# EAGLE design EXT_ADIN (EAGLE 6.5.0)
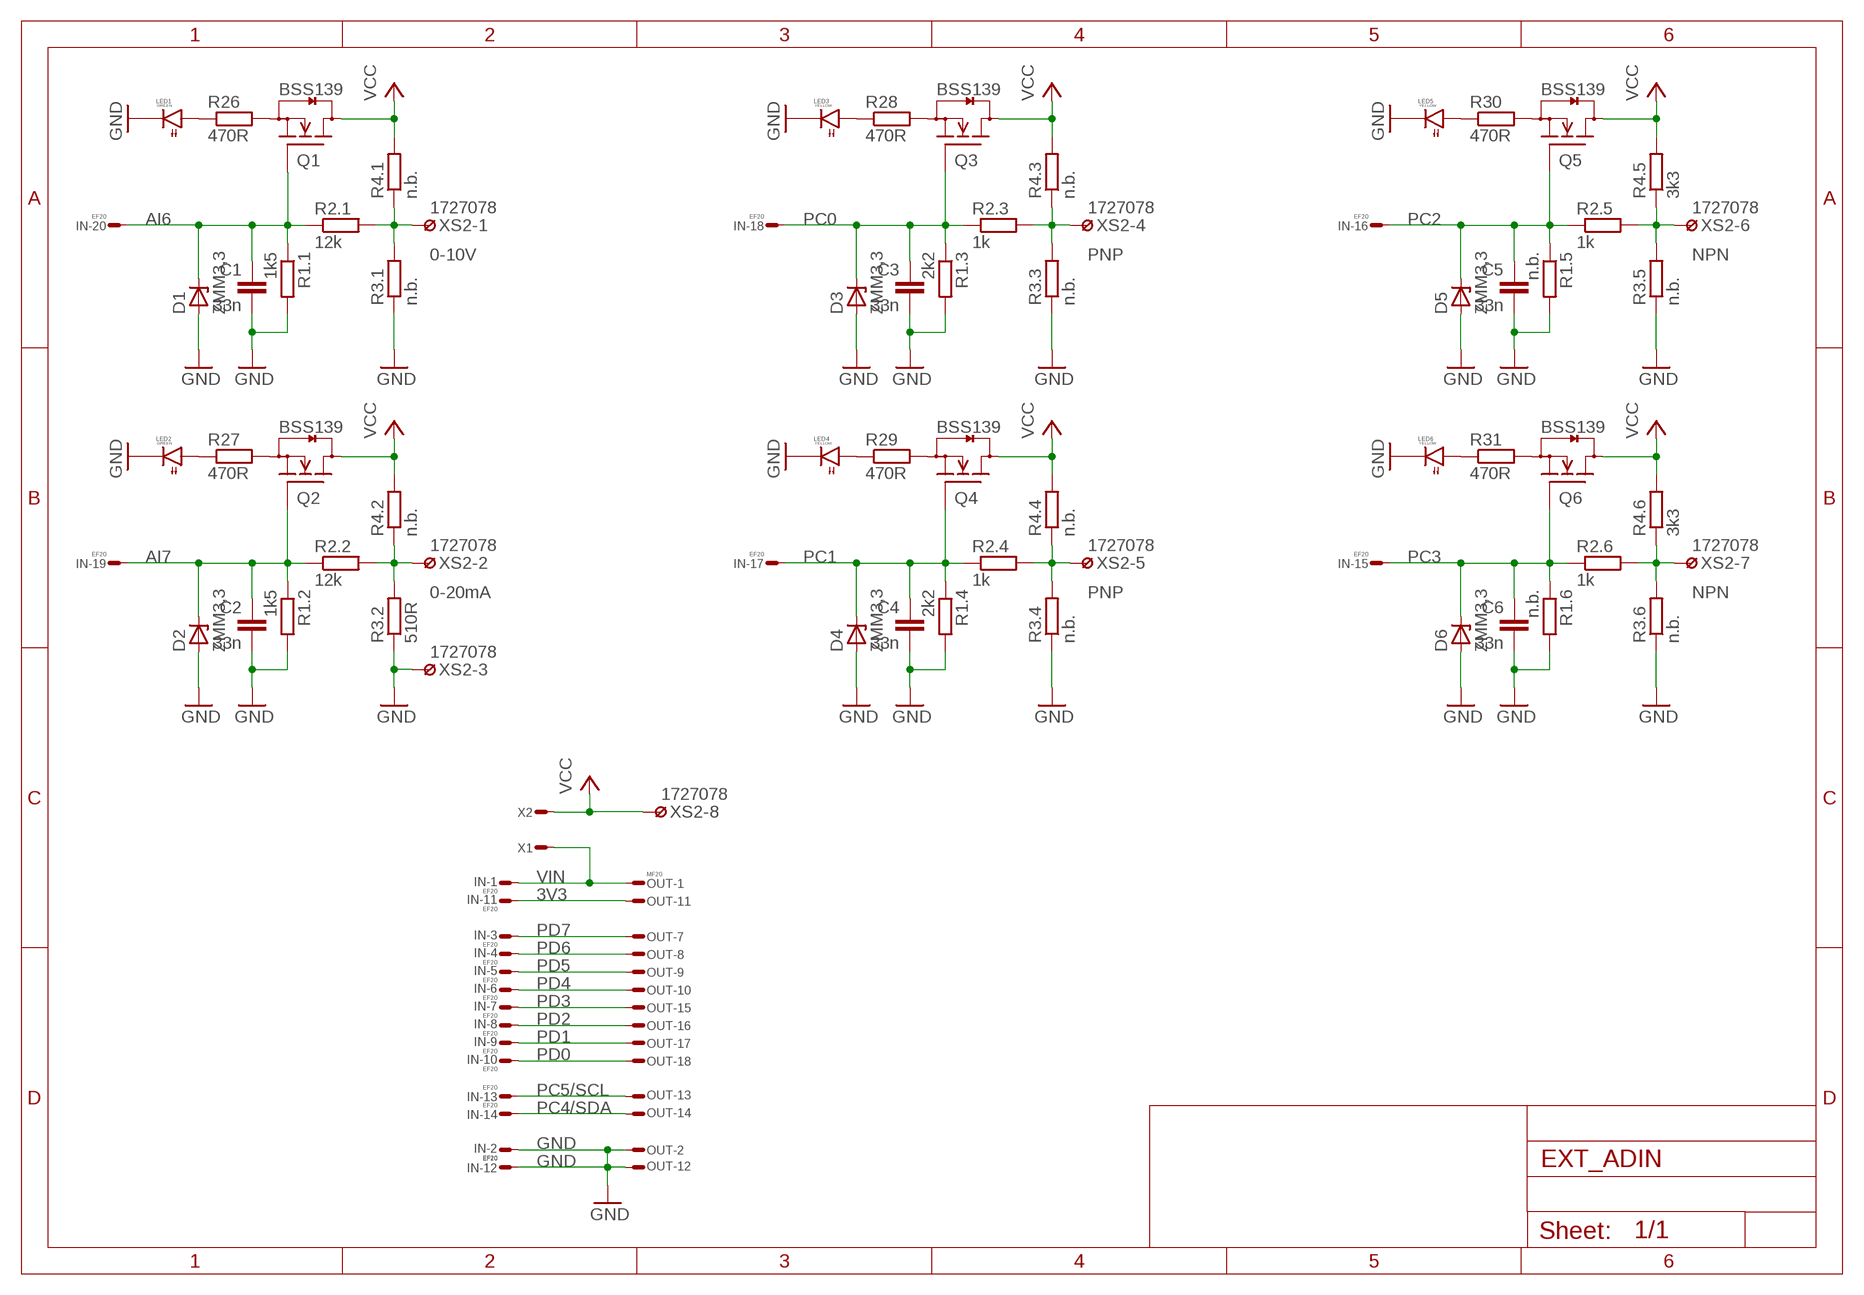
[diagram p0: schematic, sheet 1]

## Parts
C1  33n  C1206  [1206]
C2  33n  C1206  [1206]
C3  33n  C1206  [1206]
C4  33n  C1206  [1206]
C5  33n  C1206  [1206]
C6  33n  C1206  [1206]
D1  ZMM3,3  ZDSOD80  [SOD80]
D2  ZMM3,3  ZDSOD80  [SOD80]
D3  ZMM3,3  ZDSOD80  [SOD80]
D4  ZMM3,3  ZDSOD80  [SOD80]
D5  ZMM3,3  ZDSOD80  [SOD80]
D6  ZMM3,3  ZDSOD80  [SOD80]
IN  EF20  FE20ELSS  [FE10-2WSS]
LED1  GREEN  LED1206  [1206]
LED2  GREEN  LED1206  [1206]
LED3  YELLOW  LED1206  [1206]
LED4  YELLOW  LED1206  [1206]
LED5  YELLOW  LED1206  [1206]
LED6  YELLOW  LED1206  [1206]
OUT  MF20  ML20LSE  [ML20LS]
Q1  BSS139  FET-ND23  [SOT23]
Q2  BSS139  FET-ND23  [SOT23]
Q3  BSS139  FET-ND23  [SOT23]
Q4  BSS139  FET-ND23  [SOT23]
Q5  BSS139  FET-ND23  [SOT23]
Q6  BSS139  FET-ND23  [SOT23]
R1.1  1k5  R1206  [1206]
R1.2  1k5  R1206  [1206]
R1.3  2k2  R1206  [1206]
R1.4  2k2  R1206  [1206]
R1.5  n.b.  R1206  [1206]
R1.6  n.b.  R1206  [1206]
R2.1  12k  R1206  [1206]
R2.2  12k  R1206  [1206]
R2.3  1k  R1206  [1206]
R2.4  1k  R1206  [1206]
R2.5  1k  R1206  [1206]
R2.6  1k  R1206  [1206]
R3.1  n.b.  R1206  [1206]
R3.2  510R  R1206  [1206]
R3.3  n.b.  R1206  [1206]
R3.4  n.b.  R1206  [1206]
R3.5  n.b.  R1206  [1206]
R3.6  n.b.  R1206  [1206]
R4.1  n.b.  R1206  [1206]
R4.2  n.b.  R1206  [1206]
R4.3  n.b.  R1206  [1206]
R4.4  n.b.  R1206  [1206]
R4.5  3k3  R1206  [1206]
R4.6  3k3  R1206  [1206]
R26  470R  R1206  [1206]
R27  470R  R1206  [1206]
R28  470R  R1206  [1206]
R29  470R  R1206  [1206]
R30  470R  R1206  [1206]
R31  470R  R1206  [1206]
X1  WIREPADT1.6/0.9  [T1.6/0.9]
X2  WIREPADT1.6/0.9  [T1.6/0.9]
XS2  1727078  CON8-SS381  [1727078]

## Nets
3V3: IN.P$11 OUT.P$11
AI6: C1.1 D1.C IN.P$20 Q1.1(G) R1.1.1 R2.1.1
AI7: C2.1 D2.C IN.P$19 Q2.1(G) R1.2.1 R2.2.1
GND: C1.2 C2.2 C3.2 C4.2 C5.2 C6.2 D1.A D2.A D3.A D4.A D5.A D6.A IN.P$2 IN.P$12 LED1.2(C) LED2.2(C) LED3.2(C) LED4.2(C) LED5.2(C) LED6.2(C) OUT.P$2 OUT.P$12 R1.1.2 R1.2.2 R1.3.2 R1.4.2 R1.5.2 R1.6.2 R3.1.1 R3.2.1 R3.3.1 R3.4.1 R3.5.1 R3.6.1 XS2.P$3
N$1: R2.2.2 R3.2.2 R4.2.1 XS2.P$2
N$2: R2.3.2 R3.3.2 R4.3.1 XS2.P$4
N$3: R2.1.2 R3.1.2 R4.1.1 XS2.P$1
N$4: R2.4.2 R3.4.2 R4.4.1 XS2.P$5
N$5: R2.5.2 R3.5.2 R4.5.1 XS2.P$6
N$6: R2.6.2 R3.6.2 R4.6.1 XS2.P$7
N$8: LED1.1(A) R26.1
N$9: Q1.2(S) R26.2
N$10: LED2.1(A) R27.1
N$11: Q2.2(S) R27.2
N$12: LED3.1(A) R28.1
N$13: Q3.2(S) R28.2
N$14: LED4.1(A) R29.1
N$15: Q4.2(S) R29.2
N$16: LED5.1(A) R30.1
N$17: Q5.2(S) R30.2
N$18: LED6.1(A) R31.1
N$19: Q6.2(S) R31.2
PC0: C3.1 D3.C IN.P$18 Q3.1(G) R1.3.1 R2.3.1
PC1: C4.1 D4.C IN.P$17 Q4.1(G) R1.4.1 R2.4.1
PC2: C5.1 D5.C IN.P$16 Q5.1(G) R1.5.1 R2.5.1
PC3: C6.1 D6.C IN.P$15 Q6.1(G) R1.6.1 R2.6.1
PC4/SDA: IN.P$14 OUT.P$14
PC5/SCL: IN.P$13 OUT.P$13
PD0: IN.P$10 OUT.P$18
PD1: IN.P$9 OUT.P$17
PD2: IN.P$8 OUT.P$16
PD3: IN.P$7 OUT.P$15
PD4: IN.P$6 OUT.P$10
PD5: IN.P$5 OUT.P$9
PD6: IN.P$4 OUT.P$8
PD7: IN.P$3 OUT.P$7
VCC: Q1.3(D) Q2.3(D) Q3.3(D) Q4.3(D) Q5.3(D) Q6.3(D) R4.1.2 R4.2.2 R4.3.2 R4.4.2 R4.5.2 R4.6.2 X2.1(S) XS2.P$8
VIN: IN.P$1 OUT.P$1 X1.1(S)
Unconnected: OUT.P$3 OUT.P$4 OUT.P$5 OUT.P$6 OUT.P$19 OUT.P$20

## Notes on the sheet
- 0-10V | PNP | NPN
- 0-20mA | PNP | NPN

## Library data of the parts
C1-C6 = RCL:C: Capacitor SMD
D1-D6 = Diode:ZD
IN = Conn:FE20E
LED1-LED6 = Optic:LED
OUT = Conn:ML20?E: HARTING
Q1-Q6 = Transistor:FET-ND
R1.1-R1.6 R2.1-R2.6 R3.1-R3.6 R4.1-R4.6 R26-R31 = RCL:R: Resistor SMD
X1 X2 = Conn:WIREPAD: Wire PAD connect wire on PCB
XS2 = Conn:CON8-S

## Board
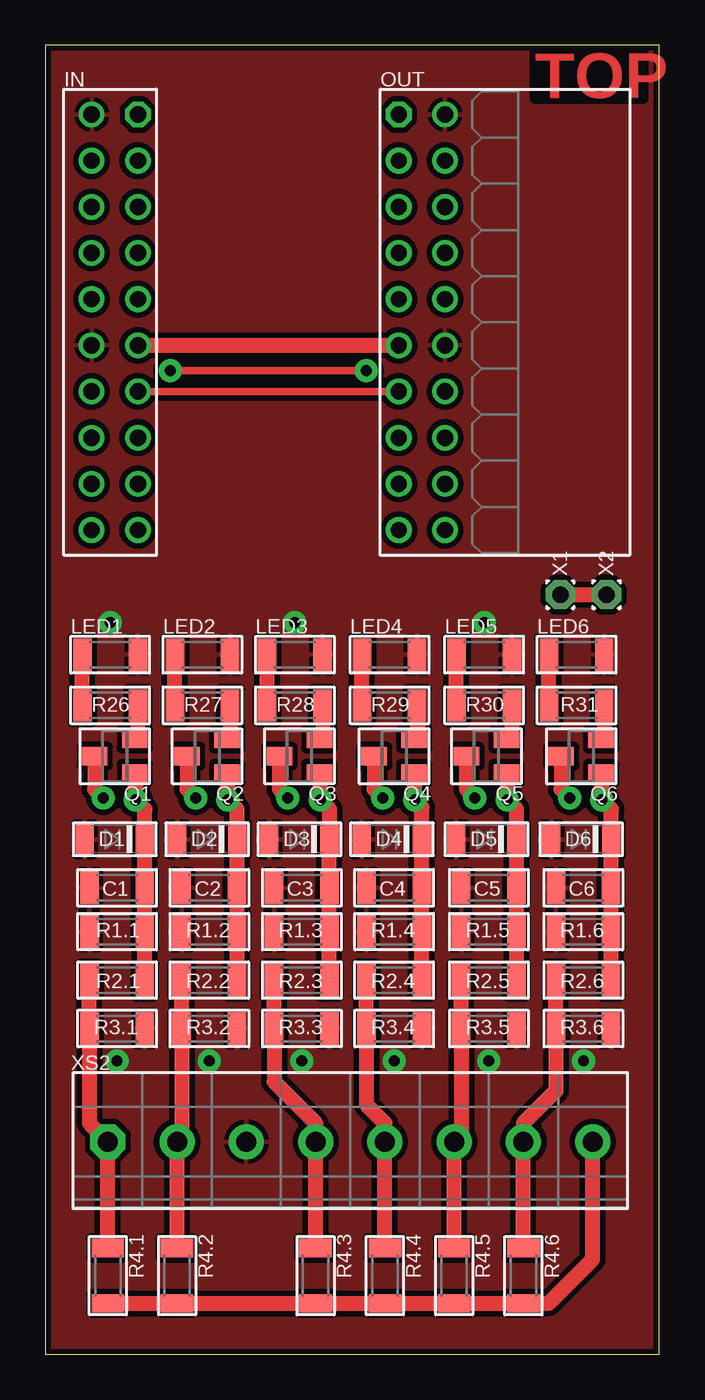
[diagram p1: board, top side]
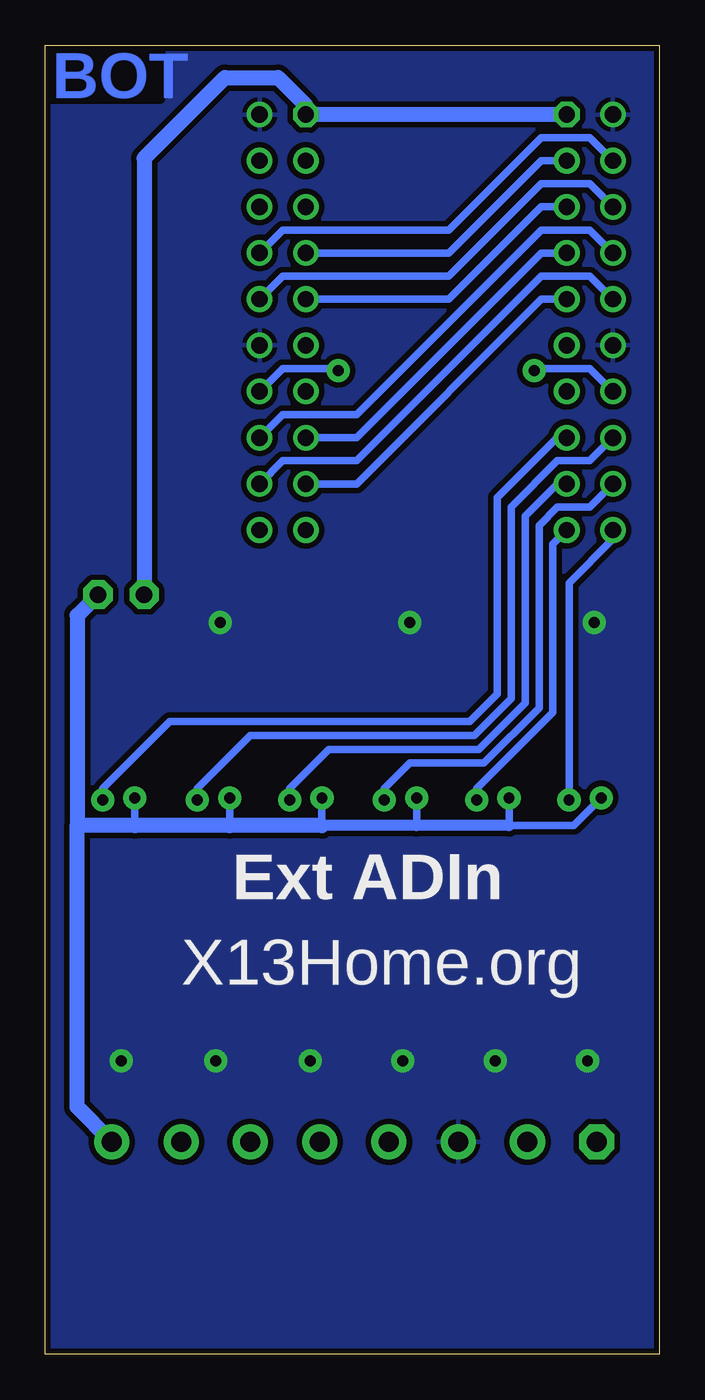
[diagram p2: board, bottom side, seen from below]

Size 33.75 x 72 mm. Coordinates in mm from the lower left corner, seen from the top.
Outline: 0,0 33.75,0 33.75,72 0,72 0,0
Copper layers (1*16): Top 0.035mm / dielectric 1.5mm / Bottom 0.035mm
Design rules "default *": minimum track width 10mil, minimum drill 10mil, track to track 12mil, track to pad 12mil, pad to pad 12mil, via to via 12mil, smd to smd 12mil, copper to edge 12mil, drill to drill 8mil, minimum pad ring 10mil, minimum via ring 8mil, stop-mask expansion 4mil, vias tented up to drill 0mil, thermal gap 10mil
tKeepout: area 0,0 to 33.8,2; area 0,70 to 33.8,72

### Footprints (pad centres in the part's own frame; a part is rotated, then mirrored left to right if it is on the bottom)
1206 = smd 1.016 x 1.778: 1 -1.524,0; 2 1.524,0
SOD80 = smd 1 x 1.7: A 1.655,0; C -1.655,0
FE10-2WSS = drill 0.9 octagon: P$1 -11.43,1.27 | drill 0.9: P$2 -11.43,-1.27; P$3 -8.89,1.27; P$4 -8.89,-1.27; P$5 -6.35,1.27; P$6 -6.35,-1.27; P$7 -3.81,1.27; P$8 -3.81,-1.27; P$9 -1.27,1.27; P$10 -1.27,-1.27; P$11 1.27,1.27; P$12 1.27,-1.27; P$13 3.81,1.27; P$14 3.81,-1.27; P$15 6.35,1.27; P$16 6.35,-1.27; P$17 8.89,1.27; P$18 8.89,-1.27; P$19 11.43,1.27; P$20 11.43,-1.27
ML20LS = drill 0.9 octagon: P$1 -11.43,-1.27 | drill 0.9: P$2 -11.43,1.27; P$3 -8.89,-1.27; P$4 -8.89,1.27; P$5 -6.35,-1.27; P$6 -6.35,1.27; P$7 -3.81,-1.27; P$8 -3.81,1.27; P$9 -1.27,-1.27; P$10 -1.27,1.27; P$11 1.27,-1.27; P$12 1.27,1.27; P$13 3.81,-1.27; P$14 3.81,1.27; P$15 6.35,-1.27; P$16 6.35,1.27; P$17 8.89,-1.27; P$18 8.89,1.27; P$19 11.43,-1.27; P$20 11.43,1.27
SOT23 = smd 1 x 1.4: 1 -0.95,-1.1; 2 0.95,-1.1; 3 0,1.1
T1.6/0.9 = drill 0.914 pad 1.6 octagon: 1 0,0
1727078 = drill 1.1 pad 1.93 octagon: P$1 -13.335,0 | drill 1.1 pad 1.93: P$2 -9.525,0; P$3 -5.715,0; P$4 -1.905,0; P$5 1.905,0; P$6 5.715,0; P$7 9.525,0; P$8 13.335,0

### Placement (x,y rotation side)
C1  3.94,25.65 180 top
C2  9.02,25.65 180 top
C3  14.1,25.65 180 top
C4  19.18,25.65 180 top
C5  24.38,25.65 180 top
C6  29.59,25.65 180 top
D1  3.81,28.32 180 top
D2  8.89,28.32 180 top
D3  13.97,28.32 180 top
D4  19.05,28.32 180 top
D5  24.26,28.32 180 top
D6  29.46,28.32 180 top
IN  3.81,56.77 270 top
LED1  3.56,38.48 0 top
LED2  8.64,38.48 0 top
LED3  13.72,38.48 0 top
LED4  18.92,38.48 0 top
LED5  24.13,38.48 0 top
LED6  29.21,38.48 0 top
OUT  20.7,56.77 270 top
Q1  3.81,32.89 90 top
Q2  8.89,32.89 90 top
Q3  13.97,32.89 90 top
Q4  19.18,32.89 90 top
Q5  24.26,32.89 90 top
Q6  29.46,32.89 90 top
R1.1  3.94,23.24 180 top
R1.2  9.02,23.24 180 top
R1.3  14.1,23.24 180 top
R1.4  19.18,23.24 180 top
R1.5  24.38,23.24 180 top
R1.6  29.59,23.24 180 top
R2.1  3.94,20.57 180 top
R2.2  9.02,20.57 180 top
R2.3  14.1,20.57 180 top
R2.4  19.18,20.57 180 top
R2.5  24.38,20.57 180 top
R2.6  29.59,20.57 180 top
R3.1  3.94,17.91 180 top
R3.2  9.02,17.91 180 top
R3.3  14.1,17.91 180 top
R3.4  19.18,17.91 180 top
R3.5  24.38,17.91 180 top
R3.6  29.59,17.91 180 top
R4.1  3.43,4.32 270 top
R4.2  7.24,4.32 270 top
R4.3  14.86,4.32 270 top
R4.4  18.67,4.32 270 top
R4.5  22.48,4.32 270 top
R4.6  26.29,4.32 270 top
R26  3.56,35.69 0 top
R27  8.64,35.69 0 top
R28  13.72,35.69 0 top
R29  18.92,35.69 0 top
R30  24.13,35.69 0 top
R31  29.21,35.69 0 top
X1  28.32,41.78 90 top
X2  30.86,41.78 90 top
XS2  16.76,11.68 0 top

### Tracks (layer width: path | path; a pad name or v marks a point on that pad's centre or on a via)
3V3
  Top 0.813: IN.P$11 OUT.P$11
AI6  (via drill 0.6 pad 1.27)
  Top 0.813: Q1.1 4.95,31.9 v4.95,30.48 5.46,29.97 D1.C C1.1 R1.1.1 R2.1.1
  Bottom 0.406: v4.95,30.48 4.95,42.42 2.54,44.83 IN.P$20
AI7  (via drill 0.6 pad 1.27)
  Top 0.813: Q2.1 10.03,31.9 v10.03,30.48 10.54,29.97 D2.C C2.1 R1.2.1 R2.2.1
  Bottom 0.406: IN.P$19 5.84,44.58 5.84,35.31 10.03,31.11 v10.03,30.48
GND  (via drill 0.6 pad 1.27)
  other vias: 24.13,40.26 13.72,40.26 3.56,40.26 3.94,16.13 14.1,16.13 9.02,16.13 19.18,16.13 24.38,16.13 29.59,16.13
  pour Bottom: 0,0.13 33.66,0.13 33.66,71.88 0,71.88
  pour Top: 0,0 33.66,0 33.66,71.88 0,71.88
N$1
  Top 0.813: R4.2.1 XS2.P$2 7.49,11.94 R3.2.2 R2.2.2
N$2
  Top 0.813: R4.3.1 XS2.P$4 14.86,12.7 12.57,14.99 R3.3.2 R2.3.2
N$3
  Top 0.813: R4.1.1 XS2.P$1 2.41,12.7 R3.1.2 R2.1.2
N$4
  Top 0.813: R4.4.1 XS2.P$5 18.67,12.7 17.65,13.72 R3.4.2 R2.4.2
N$5
  Top 0.813: R4.5.1 XS2.P$6 22.86,12.06 R3.5.2 R2.5.2
N$6
  Top 0.813: R4.6.1 XS2.P$7 26.29,12.7 28.07,14.48 R3.6.2 R2.6.2
N$8
  Top 0.813: R26.1 LED1.1
N$9
  Top 0.813: R26.2 5.08,34.01 Q1.2
N$10
  Top 0.813: R27.1 LED2.1
N$11
  Top 0.813: R27.2 10.16,34.01 Q2.2
N$12
  Top 0.813: R28.1 LED3.1
N$13
  Top 0.813: R28.2 15.24,34.01 Q3.2
N$14
  Top 0.813: R29.1 LED4.1
N$15
  Top 0.813: R29.2 20.45,34.01 Q4.2
N$16
  Top 0.813: R30.1 LED5.1
N$17
  Top 0.813: R30.2 25.65,34.14 Q5.2
N$18
  Top 0.813: R31.1 LED6.1
N$19
  Top 0.813: R31.2 30.73,34.01 Q6.2
PC0  (via drill 0.6 pad 1.27)
  Top 0.813: Q3.1 15.11,31.9 v15.11,30.48 15.62,29.97 D3.C C3.1 R1.3.1 R2.3.1
  Bottom 0.406: IN.P$18 3.81,46.61 5.59,46.61 6.6,45.59 6.6,35.56 9.65,32.51 13.72,32.51 15.11,31.11 v15.11,30.48
PC1  (via drill 0.6 pad 1.27)
  Top 0.813: D4.C C4.1 R1.4.1 R2.4.1 | D4.C | D4.C 20.7,30.1 v20.32,30.48 20.32,31.9 Q4.1
  Bottom 0.406: IN.P$17 5.59,47.88 7.37,46.1 7.37,35.81 9.91,33.27 18.16,33.27 20.32,31.11 v20.32,30.48
PC2  (via drill 0.6 pad 1.27)
  Top 0.813: Q5.1 25.4,31.9 v25.4,30.48 25.91,29.97 D5.C C5.1 R1.5.1 R2.5.1
  Bottom 0.406: IN.P$16 3.81,49.15 5.59,49.15 8.13,46.61 8.13,36.07 10.16,34.04 22.48,34.04 25.4,31.11 v25.4,30.48
PC3  (via drill 0.6 pad 1.27)
  Top 0.813: Q6.1 30.61,31.9 v30.61,30.48 31.12,29.97 D6.C C6.1 R1.6.1 R2.6.1
  Bottom 0.406: IN.P$15 5.59,50.42 8.89,47.12 8.89,36.32 10.41,34.8 26.92,34.8 30.61,31.11 v30.61,30.48
PC4/SDA  (via drill 0.6 pad 1.27)
  Top 0.406: v6.86,54.1 v17.65,54.1
  Bottom 0.406: IN.P$14 3.81,54.23 6.73,54.23 v6.86,54.1 | v17.65,54.1 17.78,54.23 20.7,54.23 OUT.P$14
PC5/SCL
  Top 0.406: IN.P$13 OUT.P$13
PD0
  Bottom 0.406: IN.P$10 3.81,59.31 6.48,59.31 16.64,49.15 20.7,49.15 OUT.P$18
PD1
  Bottom 0.406: IN.P$9 6.48,58.04 16.64,47.88 OUT.P$17
PD2
  Bottom 0.406: IN.P$8 3.81,61.85 6.48,61.85 16.64,51.69 20.7,51.69 OUT.P$16
PD3
  Bottom 0.406: IN.P$7 6.48,60.58 16.64,50.42 OUT.P$15
PD4
  Bottom 0.406: IN.P$6 3.81,64.39 6.48,64.39 11.56,59.31 20.7,59.31 OUT.P$10
PD5
  Bottom 0.406: IN.P$5 6.48,63.12 11.56,58.04 OUT.P$9
PD6
  Bottom 0.406: IN.P$4 3.81,66.93 6.48,66.93 11.56,61.85 20.7,61.85 OUT.P$8
PD7
  Bottom 0.406: IN.P$3 6.48,65.66 11.56,60.58 OUT.P$7
VCC  (via drill 0.6 pad 1.27)
  Top 0.813: R4.1.2 R4.2.2 R4.3.2 R4.4.2 R4.5.2 R4.6.2 27.69,2.79 30.1,5.21 XS2.P$8 | Q1.3 2.71,31.07 v3.17,30.61 | Q2.3 7.79,31.07 v8.26,30.61 | Q3.3 12.87,31.07 v13.34,30.61 | Q4.3 18.08,31.07 v18.54,30.61 | Q5.3 23.16,31.07 v23.62,30.61 | Q6.3 28.36,31.07 v28.83,30.61
  Bottom 0.406: v3.17,30.61 4.7,29.08 8.26,29.08 v8.26,30.61 | v13.34,30.61 13.34,29.08 | v18.54,30.61 18.54,29.08 | v23.62,30.61 23.62,29.08 | v28.83,30.61 28.83,29.08
  Bottom 0.61: 8.26,29.08 13.34,29.08 18.54,29.08
  Bottom 0.813: 18.54,29.08 23.62,29.08 28.83,29.08 32,29.08 | X2.1 32,40.64 32,29.08 | XS2.P$8 32,13.59 32,29.08
VIN
  Top 0.813: X1.1 30.86,41.78
  Bottom 0.813: IN.P$1 OUT.P$1 19.43,68.71 20.95,70.23 23.88,70.23 28.32,65.79 X1.1

### Text on the board
Top: TOP
Bottom: BOT
bNames: Ext ADIn | X13Home.org